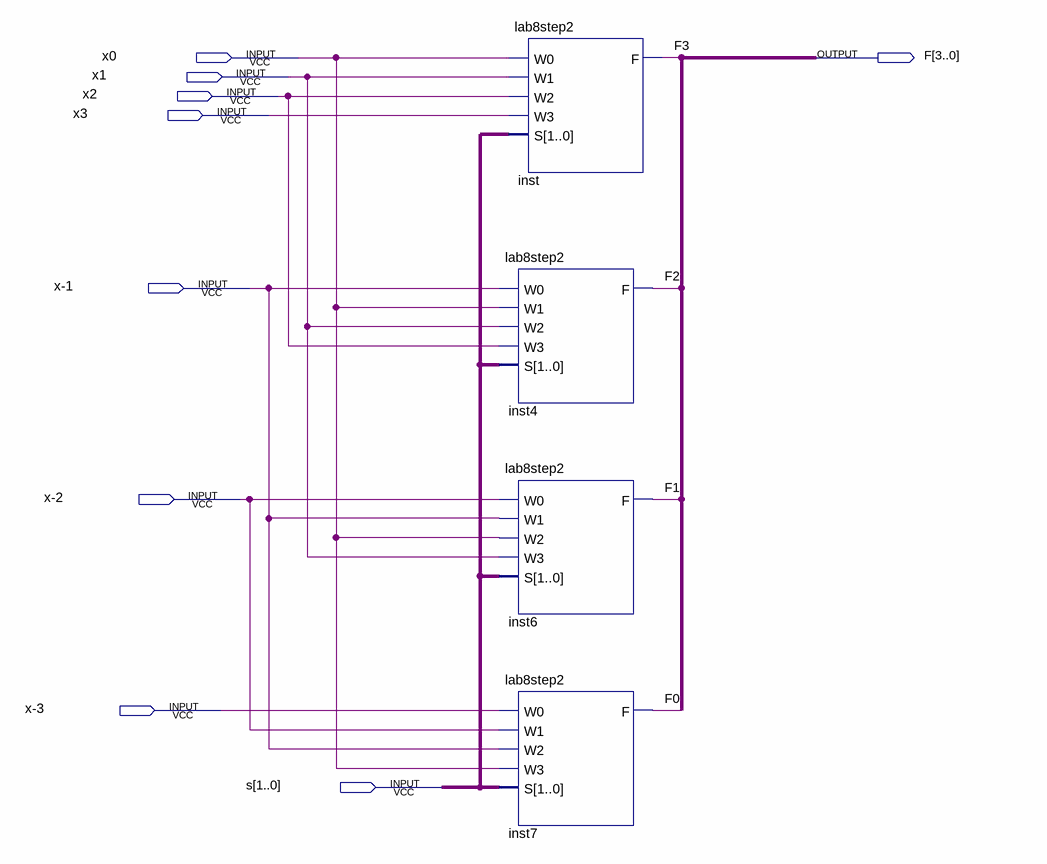
[diagram p0: schematic sheet]
// Quartus schematic lab8step3.bdf as structural Verilog: 4 symbols, 9 pins
module lab8step3 (
  input  x0,
  input  x1,
  input  x2,
  input  x3,
  input  \x-1 ,
  input  \x-2 ,
  input  \x-3 ,
  input  [1:0] s,
  output [3:0] F
);

  lab8step2 inst (.W0(x0), .W1(x1), .W2(x2), .W3(x3), .S(s), .F(F[3]));
  lab8step2 inst4 (.W0(\x-1 ), .W1(x0), .W2(x1), .W3(x2), .S(s), .F(F[2]));
  lab8step2 inst6 (.W0(\x-2 ), .W1(\x-1 ), .W2(x0), .W3(x1), .S(s), .F(F[1]));
  lab8step2 inst7 (.W0(\x-3 ), .W1(\x-2 ), .W2(\x-1 ), .W3(x0), .S(s), .F(F[0]));
endmodule
